# Altium schematic sheet Anchor.SchDoc
size A3; SheetNumber: 1; SheetTotal: 1
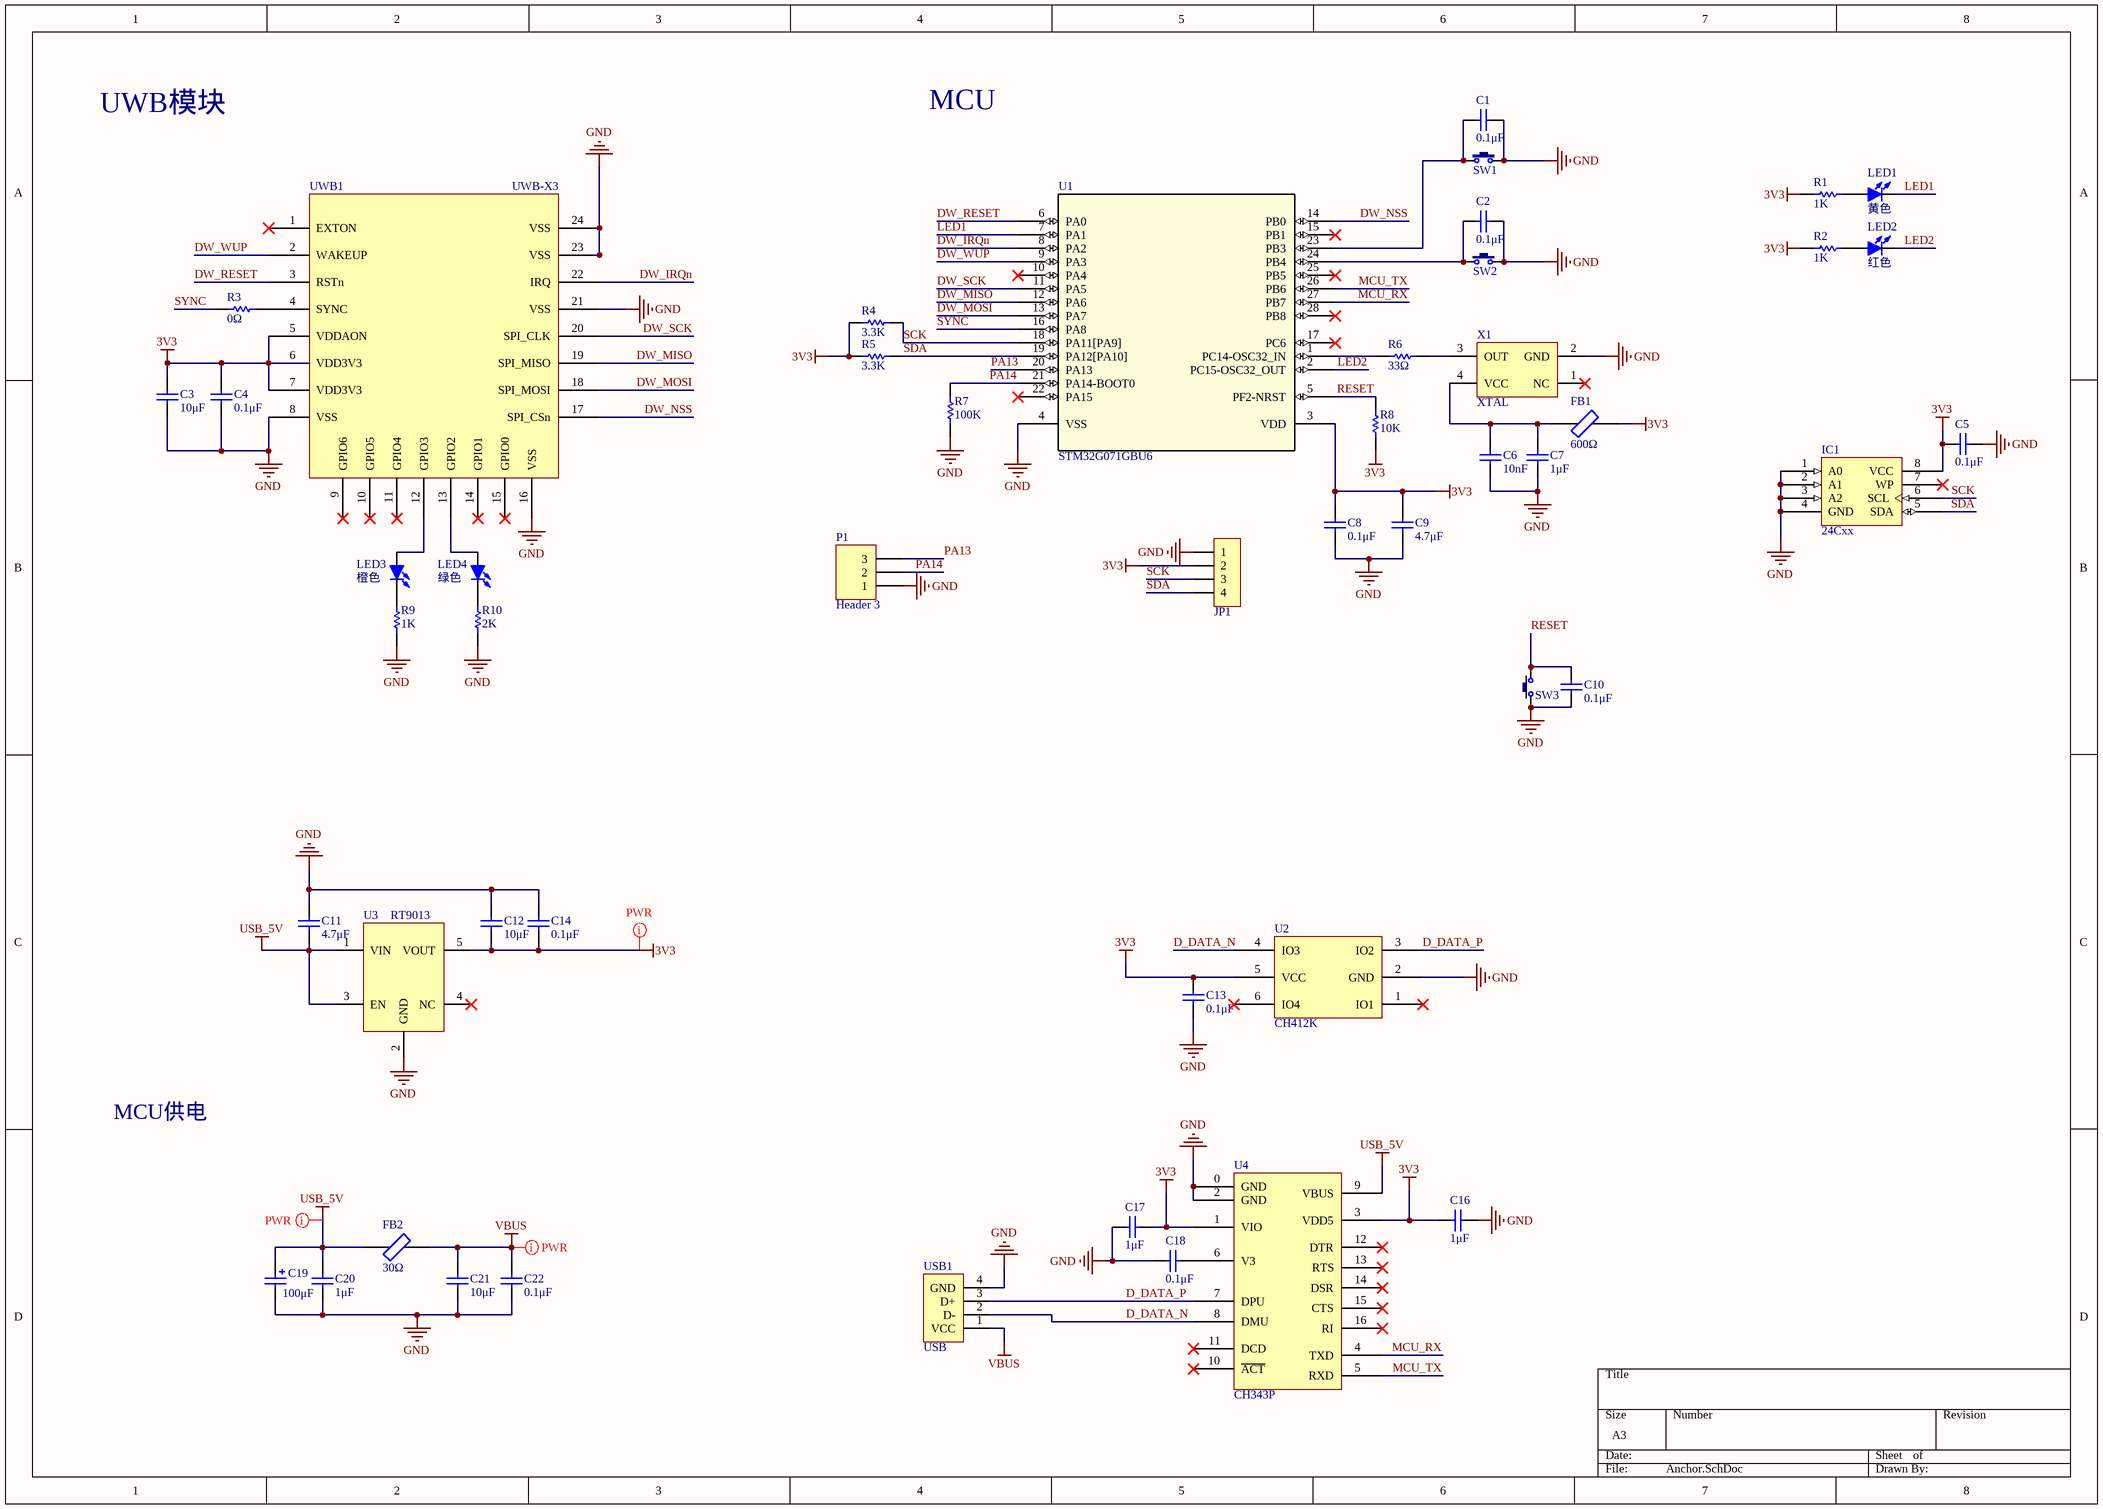
[diagram p0: Anchor.SchDoc]

## Parts
C1  value 0.1μF  [C 0603_L]  (hidden comment: Cap)
C2  value 0.1μF  [C 0603_L]  (hidden comment: Cap)
C3  value 10μF  [C 0603_L]  (hidden comment: Cap)
C4  value 0.1μF  [C 0603_L]  (hidden comment: Cap)
C5  value 0.1μF  [C 0603_L]  (hidden comment: Cap)
C6  value 10nF  [C 0603_L]  (hidden comment: Cap)
C7  value 1μF  [C 0603_L]  (hidden comment: Cap)
C8  value 0.1μF  [C 0603_L]  (hidden comment: Cap)
C9  value 4.7μF  [C 0603_L]  (hidden comment: Cap)
C10  value 0.1μF  [C 0603_L]  (hidden comment: Cap)
C11  value 4.7μF  [C 0603_L]  (hidden comment: Cap)
C12  value 10μF  [C 0603_L]  (hidden comment: Cap)
C13  value 0.1μF  [C 0603_L]  (hidden comment: Cap)
C14  value 0.1μF  [C 0603_L]  (hidden comment: Cap)
C16  value 1μF  [C 0603_L]  (hidden comment: Cap)
C17  value 1μF  [C 0603_L]  (hidden comment: Cap)
C18  value 0.1μF  [C 0603_L]  (hidden comment: Cap)
C19  value 100μF  [CM C(5*5.4)]  (hidden comment: Cap Pol1)
C20  value 1μF  [C 0603_L]  (hidden comment: Cap)
C21  value 10μF  [C 0603_L]  (hidden comment: Cap)
C22  value 0.1μF  [C 0603_L]  (hidden comment: Cap)
FB1  value 600Ω  [C 0603_L]  (hidden comment: Ferrite bead)
FB2  value 30Ω  [C 0603_L]  (hidden comment: Ferrite bead)
IC1  24Cxx  [SOP8_L]
JP1  HDR-1X4  [HDR2.54-LI-4P]  (value not drawn)
LED1  黄色  [LED 0805G]
LED2  红色  [LED 0805R]
LED3  橙色  [LED 0805G]
LED4  绿色  [LED 0805G]
P1  Header 3  [HDR2.54-LI-3P]
R1  value 1K  [R 0603_L]  (hidden comment: Resistor)
R2  value 1K  [R 0603_L]  (hidden comment: Resistor)
R3  value 0Ω  [R 0603_L]  (hidden comment: Resistor)
R4  value 3.3K  [R 0603_L]  (hidden comment: Resistor)
R5  value 3.3K  [R 0603_L]  (hidden comment: Resistor)
R6  value 33Ω  [R 0603_L]  (hidden comment: Resistor)
R7  value 100K  [R 0603_L]  (hidden comment: Resistor)
R8  value 10K  [R 0603_L]  (hidden comment: Resistor)
R9  value 1K  [R 0603_L]  (hidden comment: Resistor)
R10  value 2K  [R 0603_L]  (hidden comment: Resistor)
SW1  3x6x5  [TSW SMD-3*6*2.5]  (value not drawn)
SW2  3x6x5  [TSW SMD-3*6*2.5]  (value not drawn)
SW3  3x6x5  [TSW SMD-3*6*2.5]  (value not drawn)
U1  STM32G071GBU6  [UFQFPN-28]
U2  CH412K  [SOT-363]
U3  RT9013  [SOT23-5L]
U4  CH343P  [QFN16]
USB1  USB  [USB_A/P_B]
UWB1  UWB-X3  [UWB-X3-MAX-IPEX]
X1  XTAL  [OSC 3225-4P]

## Nets
3V3: C3.2 C4.1 C5.2 C8.2 C9.1 C12.1 C13.2 C14.1 C16.1 C17.2 FB1.2 IC1.8(VCC) JP1.2 R1.2 R2.2 R4.1 R5.1 R8.2 U1.3(VDD) U2.5(VCC) U3.5(VOUT) U4.1(VIO) U4.3(VDD5) UWB1.5(VDDAON) UWB1.6(VDD3V3) UWB1.7(VDD3V3)
GND: C1.1 C2.1 C3.1 C4.2 C5.1 C6.1 C7.1 C8.1 C9.2 C10.1 C11.2 C12.2 C13.1 C14.2 C16.2 C17.1 C18.1 C19.2 C20.1 C21.1 C22.1 IC1.1(A0) IC1.2(A1) IC1.3(A2) IC1.4(GND) JP1.1 P1.1 R7.2 R9.2 R10.2 SW1.2 SW2.2 SW3.1 U1.4(VSS) U2.2(GND) U3.2(GND) U4.0(GND) U4.2(GND) USB1.4(GND) UWB1.8(VSS) UWB1.16(VSS) UWB1.21(VSS) UWB1.23(VSS) UWB1.24(VSS) X1.2(GND)
USB_5V: C11.1 C19.1 C20.2 FB2.1 U3.1(VIN) U3.3(EN) U4.9(VBUS)
VBUS: C21.2 C22.2 FB2.2 USB1.1(VCC)
D_DATA_N: U2.4(IO3) U4.8(DMU) USB1.2(D-)
D_DATA_P: U2.3(IO2) U4.7(DPU) USB1.3(D+)
DW_IRQn: U1.8(PA2) UWB1.22(IRQ)
DW_MISO: U1.12(PA6) UWB1.19(SPI_MISO)
DW_MOSI: U1.13(PA7) UWB1.18(SPI_MOSI)
DW_NSS: U1.14(PB0) UWB1.17(SPI_CSn)
DW_RESET: U1.6(PA0) UWB1.3(RSTn)
DW_SCK: U1.11(PA5) UWB1.20(SPI_CLK)
DW_WUP: U1.9(PA3) UWB1.2(WAKEUP)
LED1: LED1.2(K) U1.7(PA1)
LED2: LED2.2(K) U1.2(PC15-OSC32_OUT)
MCU_RX: U1.27(PB7) U4.4(TXD)
MCU_TX: U1.26(PB6) U4.5(RXD)
PA13: P1.3 U1.20(PA13)
PA14: P1.2 R7.1 U1.21(PA14-BOOT0)
RESET: C10.2 R8.1 SW3.2 U1.5(PF2-NRST)
SCK: IC1.6(SCL) JP1.3 R4.2 U1.18(PA11[PA9])
SDA: IC1.5(SDA) JP1.4 R5.2 U1.19(PA12[PA10])
SYNC: R3.1 U1.16(PA8)
NetC1_2: C1.2 SW1.1 U1.23(PB3)
NetC2_2: C2.2 SW2.1 U1.24(PB4)
NetC6_2: C6.2 C7.2 FB1.1 X1.4(VCC)
NetC18_2: C18.2 U4.6(V3)
NetLED1_1: LED1.1(A) R1.1
NetLED2_1: LED2.1(A) R2.1
NetLED3_1: LED3.1(A) UWB1.12(GPIO3)
NetLED3_2: LED3.2(K) R9.1
NetLED4_1: LED4.1(A) UWB1.13(GPIO2)
NetLED4_2: LED4.2(K) R10.1
NetR3_2: R3.2 UWB1.4(SYNC)
NetR6_1: R6.1 U1.1(PC14-OSC32_IN)
NetR6_2: R6.2 X1.3(OUT)

Not connected (* = marked no-connect by the designer): IC1 7(WP)*; U1 10(PA4)* 15(PB1)* 17(PC6)* 22(PA15)* 25(PB5)* 28(PB8)*; U2 1(IO1)* 6(IO4)*; U3 4(NC)*; U4 10(~{ACT})* 11(DCD)* 12(DTR)* 13(RTS)* 14(DSR)* 15(CTS)* 16(RI)*; UWB1 1(EXTON)* 9(GPIO6)* 10(GPIO5)* 11(GPIO4)* 14(GPIO1)* 15(GPIO0)*; X1 1(NC)*

## Layout directives
net class PWR: 3V3, USB_5V, VBUS

## Notes on the sheet
- MCU
- UWB模块
- MCU供电

## Library data of the parts
C1-C14 C16-C18 C20-C22 = Cap: Capacitor; Published: 8-Jun-2000; LatestRevisionDate: 17-Jul-2002; LatestRevisionNote: Re-released for DXP Platform.; PackageReference: RAD-0.3; Publisher: Altium Limited; PackageDescription: Radial Cap, Thru-Hole; 2 Leads; 0.3 in Pin Spacing
C19 = Cap Pol1: Polarized Capacitor (Radial); Published: 8-Jun-2000; LatestRevisionDate: 17-Jul-2002; LatestRevisionNote: Re-released for DXP Platform.; PackageReference: RB7.6-15; Publisher: Altium Limited
FB1 FB2 = Ferrite bead: 铁氧体磁珠
IC1 = 24Cxx: 外置EEPROM; 版权归属: 封装库来自淘宝 ID：黄晶宝石; BOM名称: 外置EEPROM; 唯一出售店铺网址: https://shop463601444.taobao.com
JP1 = Header 4: 4P接插件; 版权归属: 封装库来自淘宝 ID：黄晶宝石; BOM名称: 4P接插件; 学习资源: https://shop463601444.taobao.com
LED1-LED4 = LED-SMD: 贴片LED; 版权归属: 封装库来自淘宝 ID：黄晶宝石; BOM名称: 贴片LED; 学习资源: https://shop463601444.taobao.com
P1 = Header 3: Header, 3-Pin; LatestRevisionDate: 17-Jul-2002; LatestRevisionNote: Re-released for DXP Platform.; Publisher: Altium Limited
SW1-SW3 = TSW 3x6: 3x6轻触开关; 版权归属: 封装库来自淘宝 ID：黄晶宝石; BOM名称: 3x6轻触开关; 学习资源: https://shop463601444.taobao.com
U1 = STM32G071GBU6: No Description Available; Mfr_Name: STMicroelectronics; RefDes: RefDes; Type: Type
U2 = CH412K: 四路ESD保护
U3 = RT9013: LDO
U4 = CH343: USB转串口
USB1 = USB-A/P: USB-A型公接口; 版权归属: 封装库来自淘宝卖家 ID：黄晶宝石; BOM名称: USB-A型公接口; 学习资源: https://shop463601444.taobao.com
UWB1 = UWB-X3(DWM3000)
X1 = XTAL: 4脚有源晶振
R1-R10 = Resistor: Published: 8-Jun-2000; LatestRevisionDate: 17-Jul-2002; LatestRevisionNote: Re-released for DXP Platform.; PackageReference: AXIAL-0.5; Publisher: Altium Limited